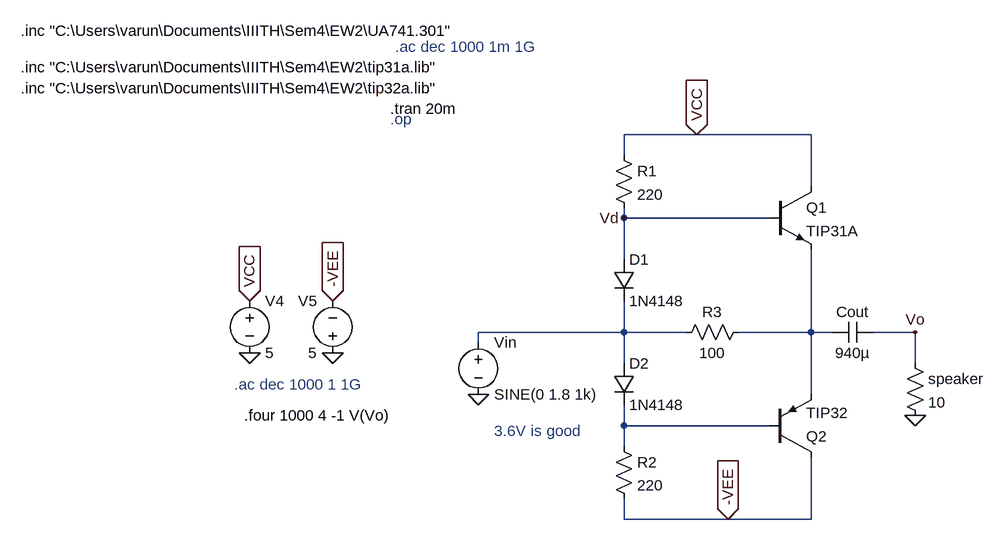
[diagram p0: schematic finalPowerAmp1.asc]
finalPowerAmp1.asc, the LTspice schematic file:
Version 4
SHEET 1 988 680
WIRE 240 -544 128 -544
WIRE 416 -544 240 -544
WIRE 128 -512 128 -544
WIRE 416 -464 416 -544
WIRE 128 -416 128 -432
WIRE 352 -416 128 -416
WIRE 128 -352 128 -416
WIRE 128 -240 128 -288
WIRE 128 -240 -96 -240
WIRE 224 -240 128 -240
WIRE 416 -240 416 -368
WIRE 416 -240 304 -240
WIRE 448 -240 416 -240
WIRE 576 -240 512 -240
WIRE -96 -224 -96 -240
WIRE 128 -192 128 -240
WIRE 576 -192 576 -240
WIRE 416 -144 416 -240
WIRE 128 -96 128 -128
WIRE 352 -96 128 -96
WIRE 128 -64 128 -96
WIRE 128 48 128 16
WIRE 288 48 128 48
WIRE 416 48 416 -48
WIRE 416 48 288 48
FLAG 576 -112 0
FLAG 576 -240 Vo
FLAG 240 -544 VCC
IOPIN 240 -544 In
FLAG 288 48 -VEE
IOPIN 288 48 In
FLAG -448 -288 VCC
IOPIN -448 -288 In
FLAG -320 -208 0
FLAG -448 -208 0
FLAG -320 -288 -VEE
IOPIN -320 -288 In
FLAG -96 -144 0
FLAG 128 -416 Vd
SYMBOL diode 112 -352 R0
SYMATTR InstName D1
SYMATTR Value 1N4148
SYMBOL diode 112 -192 R0
SYMATTR InstName D2
SYMATTR Value 1N4148
SYMBOL res 112 -528 R0
SYMATTR InstName R1
SYMATTR Value 220
SYMBOL res 112 -80 R0
SYMATTR InstName R2
SYMATTR Value 220
SYMBOL npn 352 -464 R0
SYMATTR InstName Q1
SYMATTR Value TIP31A
SYMBOL pnp 352 -48 M180
SYMATTR InstName Q2
SYMATTR Value TIP32
SYMBOL res 560 -208 R0
SYMATTR InstName speaker
SYMATTR Value 10
SYMBOL cap 512 -256 R90
WINDOW 0 0 32 VBottom 2
WINDOW 3 32 32 VTop 2
SYMATTR InstName Cout
SYMATTR Value 940µ
SYMBOL voltage -448 -304 R0
SYMATTR InstName V4
SYMATTR Value 5
SYMBOL voltage -320 -192 R180
WINDOW 0 24 96 Left 2
WINDOW 3 24 16 Left 2
SYMATTR InstName V5
SYMATTR Value 5
SYMBOL voltage -96 -240 R0
WINDOW 123 0 0 Left 0
WINDOW 39 0 0 Left 0
SYMATTR InstName Vin
SYMATTR Value SINE(0 1.8 1k)
SYMBOL res 320 -256 R90
WINDOW 0 0 56 VBottom 2
WINDOW 3 32 56 VTop 2
SYMATTR InstName R3
SYMATTR Value 100
TEXT -232 -584 Left 2 !.tran 20m
TEXT -800 -616 Left 2 !.inc "C:\\Users\\varun\\Documents\\IIITH\\Sem4\\EW2\\tip32a.lib"
TEXT -800 -648 Left 2 !.inc "C:\\Users\\varun\\Documents\\IIITH\\Sem4\\EW2\\tip31a.lib"
TEXT -224 -680 Left 2 ;.ac dec 1000 1m 1G
TEXT -472 -160 Left 2 ;.ac dec 1000 1 1G
TEXT -800 -704 Left 2 !.inc "C:\\Users\\varun\\Documents\\IIITH\\Sem4\\EW2\\UA741.301"
TEXT -232 -568 Left 2 ;.op
TEXT -456 -112 Left 2 !.four 1000 4 -1 V(Vo)
TEXT -72 -88 Left 2 ;3.6V is good

The netlist it stands for:
* finalPowerAmp1.asc
D1 Vd N001 1N4148
D2 N001 N003 1N4148
R1 VCC Vd 220
R2 N003 -VEE 220
Q1 VCC Vd N002 0 TIP31A
Q2 -VEE N003 N002 0 TIP32
R§speaker Vo 0 10
Cout Vo N002 940µ
V4 VCC 0 5
V5 0 -VEE 5
Vin N001 0 SINE(0 1.8 1k)
R3 N002 N001 100
.model D D
.lib standard.dio
.model NPN NPN
.model PNP PNP
.lib standard.bjt
.tran 20m
.inc "C:\Users\varun\Documents\IIITH\Sem4\EW2\tip32a.lib"
.inc "C:\Users\varun\Documents\IIITH\Sem4\EW2\tip31a.lib"
* .ac dec 1000 1m 1G
* .ac dec 1000 1 1G
.inc "C:\Users\varun\Documents\IIITH\Sem4\EW2\UA741.301"
* .op
.four 1000 4 -1 V(Vo)
* 3.6V is good
.backanno
.end